# Altium schematic sheet BRD220523.schdoc
size 392 x 215 mm
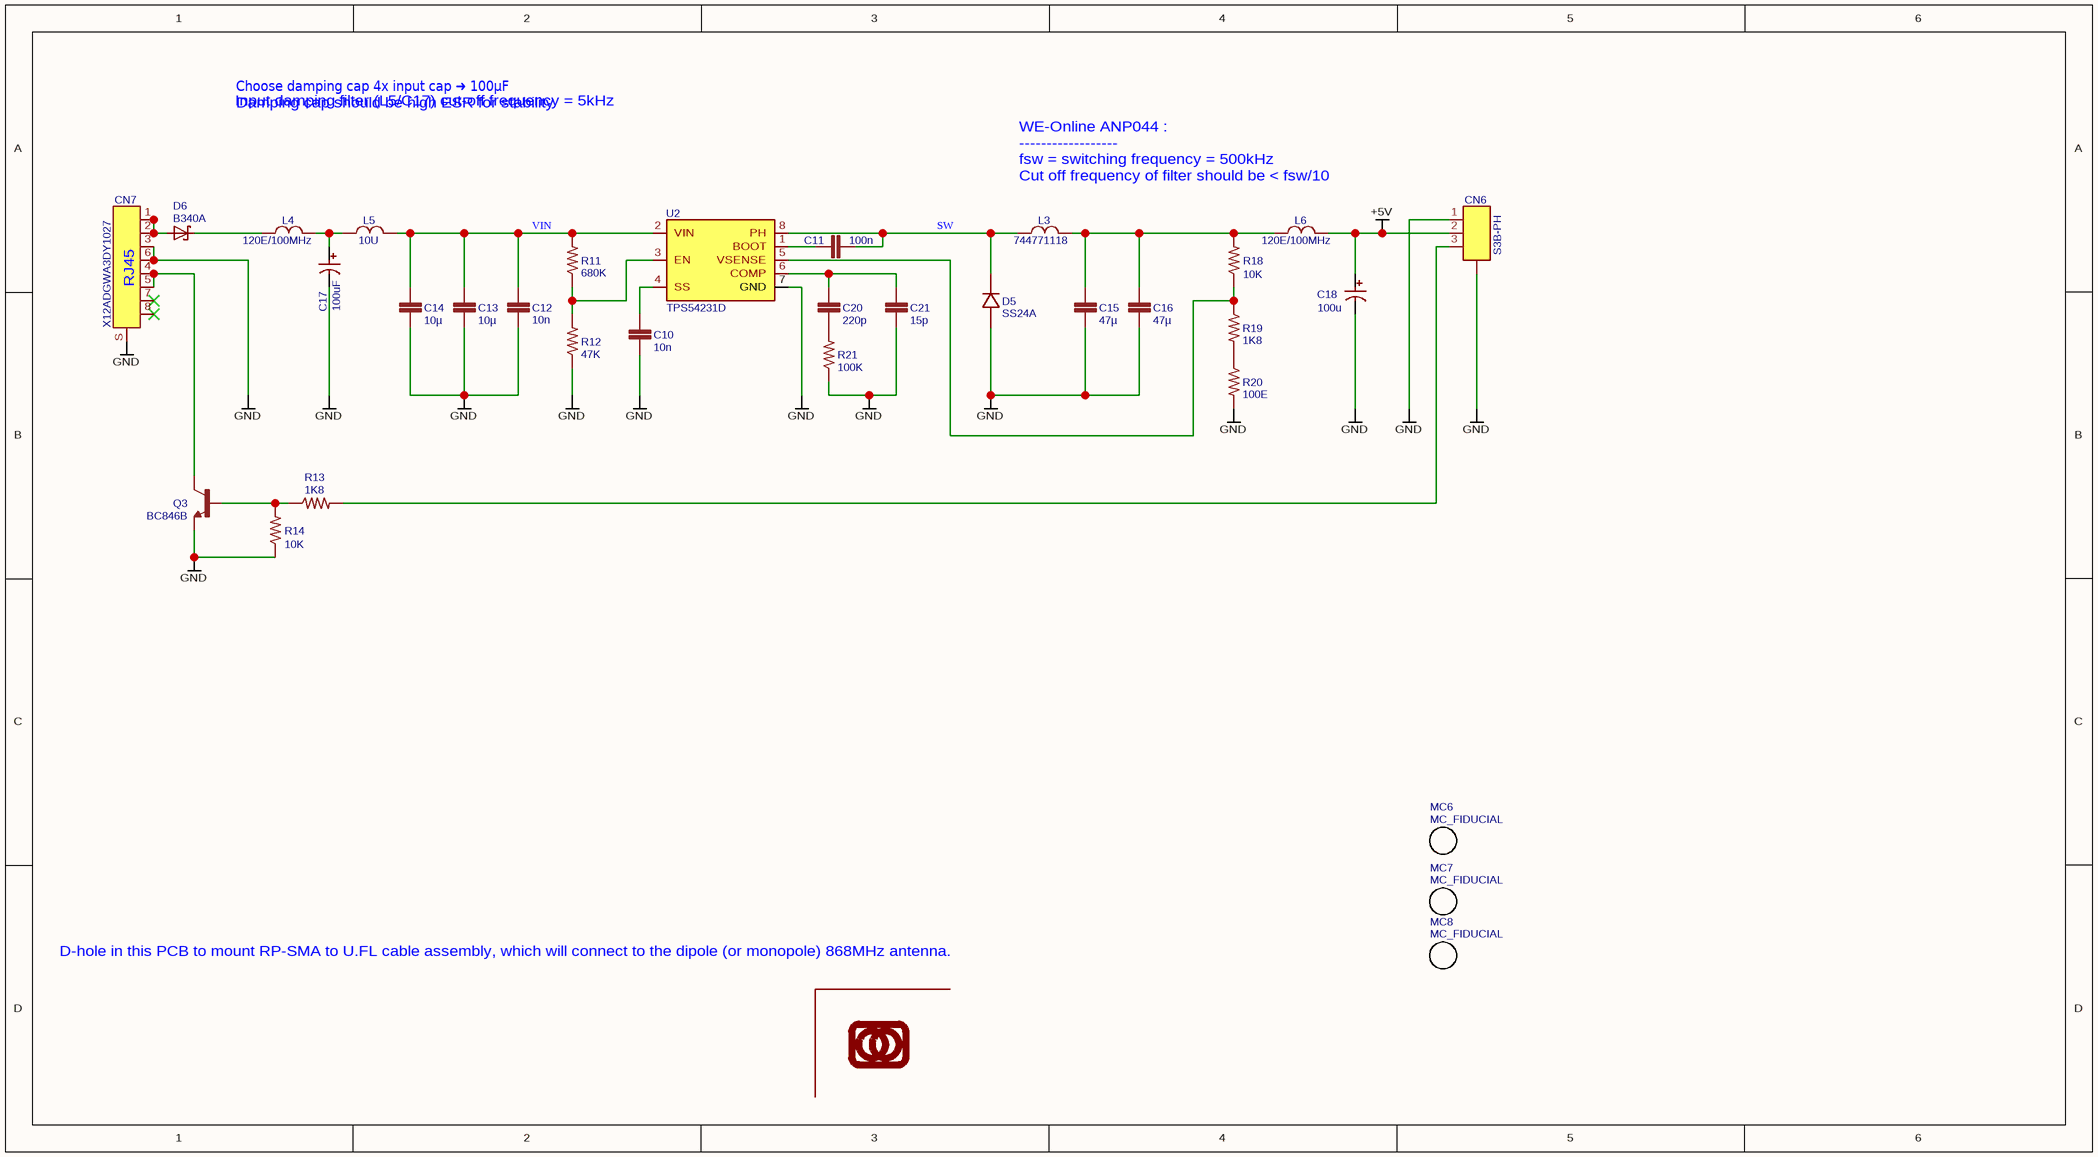
[diagram p0: BRD220523.schdoc]

## Parts
C10  10n  [CA_0603]
C11  100n  [CA_0603]
C12  10n  [CA_0603]
C13  10µ  [CA_1210]
C14  10µ  [CA_1210]
C15  47µ  [CA_1210]
C16  47µ  [CA_1210]
C17  100uF  [CA_D8.0_P3.5]
C18  100u  [CA_D8.0_P3.5]
C20  220p  [CA_0603]
C21  15p  [CA_0603]
CN6  S3B-PH  [CN_HDR_1X3_90D_P25_JST_PH_S3B]
CN7  X12ADGWA3DY1027  [CN_MODJACK_8C8P_RA_NO_LED]
D5  SS24A  [SMA_L4.4-W2.6-LS5.0-RD]
D6  B340A  [DI_DO-214AC_SMA]
L3  744771118  [CL_STD1212]
L4  120E/100MHz  [CL_1206]
L5  10U  [CL_STD6050]
L6  120E/100MHz  [CL_1206]
MC2  LIEBTRAU_LOGO  [MC_LIEBTRAU_LOGO]  (value not drawn)
MC6  MC_FIDUCIAL  [MC_FIDUCIAL]
MC7  MC_FIDUCIAL  [MC_FIDUCIAL]
MC8  MC_FIDUCIAL  [MC_FIDUCIAL]
Q3  BC846B  [SC_SOT23-3]
R11  680K  [RE_0603]
R12  47K  [RE_0603]
R13  1K8  [RE_0603]
R14  10K  [RE_0603]
R18  10K  [RE_0603]
R19  1K8  [RE_0603]
R20  100E  [RE_0603]
R21  100K  [RE_0603]
U2  TPS54231D  [SC_SO08_150MIL_BODY]

## Nets
+5V: C18.1 CN6.2 L6.2
GND: C10.2 C12.2 C13.2 C14.2 C15.2 C16.2 C17.2 C18.2 C21.2 CN6.0 CN6.1 CN7.3 CN7.6 CN7.S D5.2 Q3.2(E) R12.1 R14.1 R20.2 R21.1 U2.7(GND)
SW: C11.2 D5.1 L3.1 U2.8(PH)
VIN: C12.1 C13.1 C14.1 L5.2 R11.2 U2.2(VIN)
NetC10_1: C10.1 U2.4(SS)
NetC11_1: C11.1 U2.1(BOOT)
NetC15_1: C15.1 C16.1 L3.2 L6.1 R18.2
NetC17_1: C17.1 L4.2 L5.1
NetC20_1: C20.1 C21.1 U2.6(COMP)
NetC20_2: C20.2 R21.2
NetCN6_3: CN6.3 R13.2
NetCN7_1: CN7.1 CN7.2 D6.2(A)
NetCN7_4: CN7.4 CN7.5 Q3.3(C)
NetD6_1: D6.1(C) L4.1
NetQ3_1: Q3.1(B) R13.1 R14.2
NetR11_1: R11.1 R12.2 U2.3(EN)
NetR18_1: R18.1 R19.1 U2.5(VSENSE)
NetR19_2: R19.2 R20.1

Not connected (* = marked no-connect by the designer): CN7 7* 8*

## Notes on the sheet
- Choose damping cap 4x input cap ➜ 100µF
  Damping cap should be high ESR for stability
- Input damping filter (L5/C17) cut-off frequency = 5kHz
- (near L3) WE-Online ANP044 :
  ------------------
  fsw = switching frequency = 500kHz
  Cut off frequency of filter should be < fsw/10
- D-hole in this PCB to mount RP-SMA to U.FL cable assembly, which will connect to the dipole (or monopole) 868MHz antenna.
- (in symbol X12ADGWA3DY1027) RJ45

## Library data of the parts
C11 = 100n: description: 100n 0603 16V; Capacitance: 100nF; BOM_Supplier Part: C80516; BOM_Supplier: LCSC; spicePre: C; spiceSymbolName: 100n_0603
C13 C14 = 10µ: description: CAP CER 10UF 16V X7R 1210; BOM_Supplier Part: C116808; BOM_Supplier: LCSC; Value: 10µ; spicePre: C; spiceSymbolName: 10U/50V
C15 C16 = 47µ: description: 10V 47uF X7R ±10% 1210 Multilayer Ceramic Capacitors MLCC - SMD/SMT ROHS; BOM_Supplier Part: C84494; BOM_Supplier: LCSC; Value: 47µ; spicePre: C; spiceSymbolName: LMK325B7476KM-PR
C17 = 100uF: BOM_Manufacturer: Rubycon; BOM_Manufacturer Part: 50YXF100MEFC8X11.5; nameAlias: Capacitance; Contributor: LieBtrau; BOM_Supplier: LCSC; BOM_Supplier Part: C88728; BOM_JLCPCB Part Class: Extended Part; spicePre: C; spiceSymbolName: 50YXF100MEFC8X11.5
C18 = 100u: BOM_Manufacturer: Rubycon; BOM_Manufacturer Part: 50YXF100MEFC8X11.5; nameAlias: Capacitance; Contributor: LieBtrau; BOM_Supplier: LCSC; BOM_Supplier Part: C88728; BOM_JLCPCB Part Class: Extended Part; spicePre: C; spiceSymbolName: 50YXF100MEFC8X11.5
C20 = 220p: description: CAP CER 220PF 50V C0G/NP0 0603; BOM_Supplier Part: C106210; BOM_Supplier: LCSC; Value: 220p; spicePre: C; spiceSymbolName: C0603C221J5GAC7867
C21 = 15p: description: CAP CER 220PF 50V C0G/NP0 0603; BOM_Supplier Part: C302056; BOM_Supplier: LCSC; Value: 15p; spicePre: C; spiceSymbolName: CC0603JRNPO9BN150
CN6 = S3B-PH: BOM_Manufacturer: JST Sales America; BOM_Manufacturer Part: S3B-PH-SM4-TB(LF)(SN); TrustedParts: edac/140-503-417-060; Contributor: LieBtrau; BOM_Supplier: LCSC; BOM_Supplier Part: C2764212; BOM_JLCPCB Part Class: Extended Part; spicePre: U; spiceSymbolName: S3B-PH-SM4-TB(LF)(SN)
CN7 = X12ADGWA3DY1027: BOM_Manufacturer: XKB Connectivity(中国星坤); TrustedParts: wurth-elektronik/615008140621; Contributor: LieBtrau; BOM_Supplier: LCSC; BOM_Supplier Part: C2916453; BOM_Manufacturer Part: X12ADGWA3DY1027; spicePre: C; spiceSymbolName: X12ADGWA3DY1027
D5 = SS24A: BOM_Manufacturer: LGE(鲁光); BOM_Manufacturer Part: SS24; Contributor: LCSC; BOM_Supplier: LCSC; BOM_Supplier Part: C362422; BOM_JLCPCB Part Class: Extended Part; spicePre: D; spiceSymbolName: SS24A
D6 = B340A: BOM_Manufacturer: Diodes Incorporated; BOM_Manufacturer Part: B340AF-13; BOM_Supplier: LCSC; BOM_Supplier Part: C172880; spicePre: D; spiceSymbolName: B340A
L3 = 744771118: BOM_Manufacturer: Wuerth; Contributor: LieBtrau; Value: 18µ; BOM_Manufacturer Part: 744771118; BOM_Supplier: LCSC; BOM_Supplier Part: C2046983; spicePre: L; spiceSymbolName: 744771118
L4 L6 = 120E/100MHz: BOM_Manufacturer: Fair-Rite Products Corp.; BOM_Manufacturer Part: 2512061217Y5; Contributor: LieBtrau; BOM_Supplier: Digi-Key; BOM_Supplier Part: 1934-1427-1-ND; Inductance: 120E/100MHz; spicePre: L; spiceSymbolName: 2512061217Y5
L5 = 10U: BOM_Manufacturer: Wurth Electronics Inc.; BOM_Manufacturer Part: 74404054100; Contributor: LieBtrau; BOM_Supplier: Digi-Key; BOM_Supplier Part: 732-5519-1-ND; spicePre: L; spiceSymbolName: 10U
MC2 = LIEBTRAU_LOGO: BOM_Mounted: No; Contributor: LieBtrau; spicePre: M; spiceSymbolName: LIEBTRAU_LOGO
MC6-MC8 = MC_FIDUCIAL: Contributor: LieBtrau; BOM_Mounted: No; BOM_Manufacturer Part: MC_FIDUCIAL; spicePre: M; spiceSymbolName: MC_FIDUCIAL
R21 = 100K: BOM_Manufacturer: YAGEO; BOM_Manufacturer Part: RE0603FRE07100KL; Contributor: LieBtrau; BOM_Supplier: Digi-Key; BOM_Supplier Part: 13-RE0603FRE07100KLCT-ND; Value: 100K; spicePre: R; spiceSymbolName: RE0603FRE07100KL
U2 = TPS54231D: BOM_Manufacturer: TI(德州仪器); Contributor: lcsc; BOM_Supplier: LCSC; BOM_Supplier Part: C1355573; BOM_Manufacturer Part: TPS54231D; link: https://atta.szlcsc.comnull; spicePre: U; spiceSymbolName: TPS54231D
C10 C12 = 10n: BOM_Supplier Part: C302008; BOM_Supplier: LCSC; spicePre: C; spiceSymbolName: 10N_0603; Value: 10n
  C10: Capacitance: 10n
Q3 = BC846B: BOM_Supplier Part: C181138; BOM_Supplier: LCSC; BOM_Digi-Key: BC846BLT1GOSCT-ND; spicePre: Q; spiceSymbolName: BC846B
R11 = 680K: BOM_Supplier Part: RMCF0603FT680K; BOM_Supplier: Digi-Key; Resistance: 680K; spicePre: R; spiceSymbolName: RMCF0603FT680K
R12 = 47K: BOM_Supplier Part: RC0603FR-0747KL; BOM_Supplier: Digi-Key; Value: 47K; spicePre: R; spiceSymbolName: RC0603FR-0747KL
R13 R19 = 1K8: BOM_Supplier Part: RMCF0603FT1K80; BOM_Supplier: Digi-Key; Resistance: 1K8; spicePre: R; spiceSymbolName: RMCF0603FT1K80; Value: 1K8
R14 R18 = 10K: BOM_Supplier Part: RNCP0603FTD10K0; BOM_Supplier: Digi-Key; Resistance: 10K; spicePre: R; spiceSymbolName: 10K/0603
R20 = 100E: BOM_Supplier Part: RMCF0603FG100R; BOM_Supplier: Digi-Key; Value: 100E; spicePre: R; spiceSymbolName: RMCF0603FG100R